# EAGLE board DUE3DOM 18052016_1322 (EAGLE 7.5.0), part 1 of 2
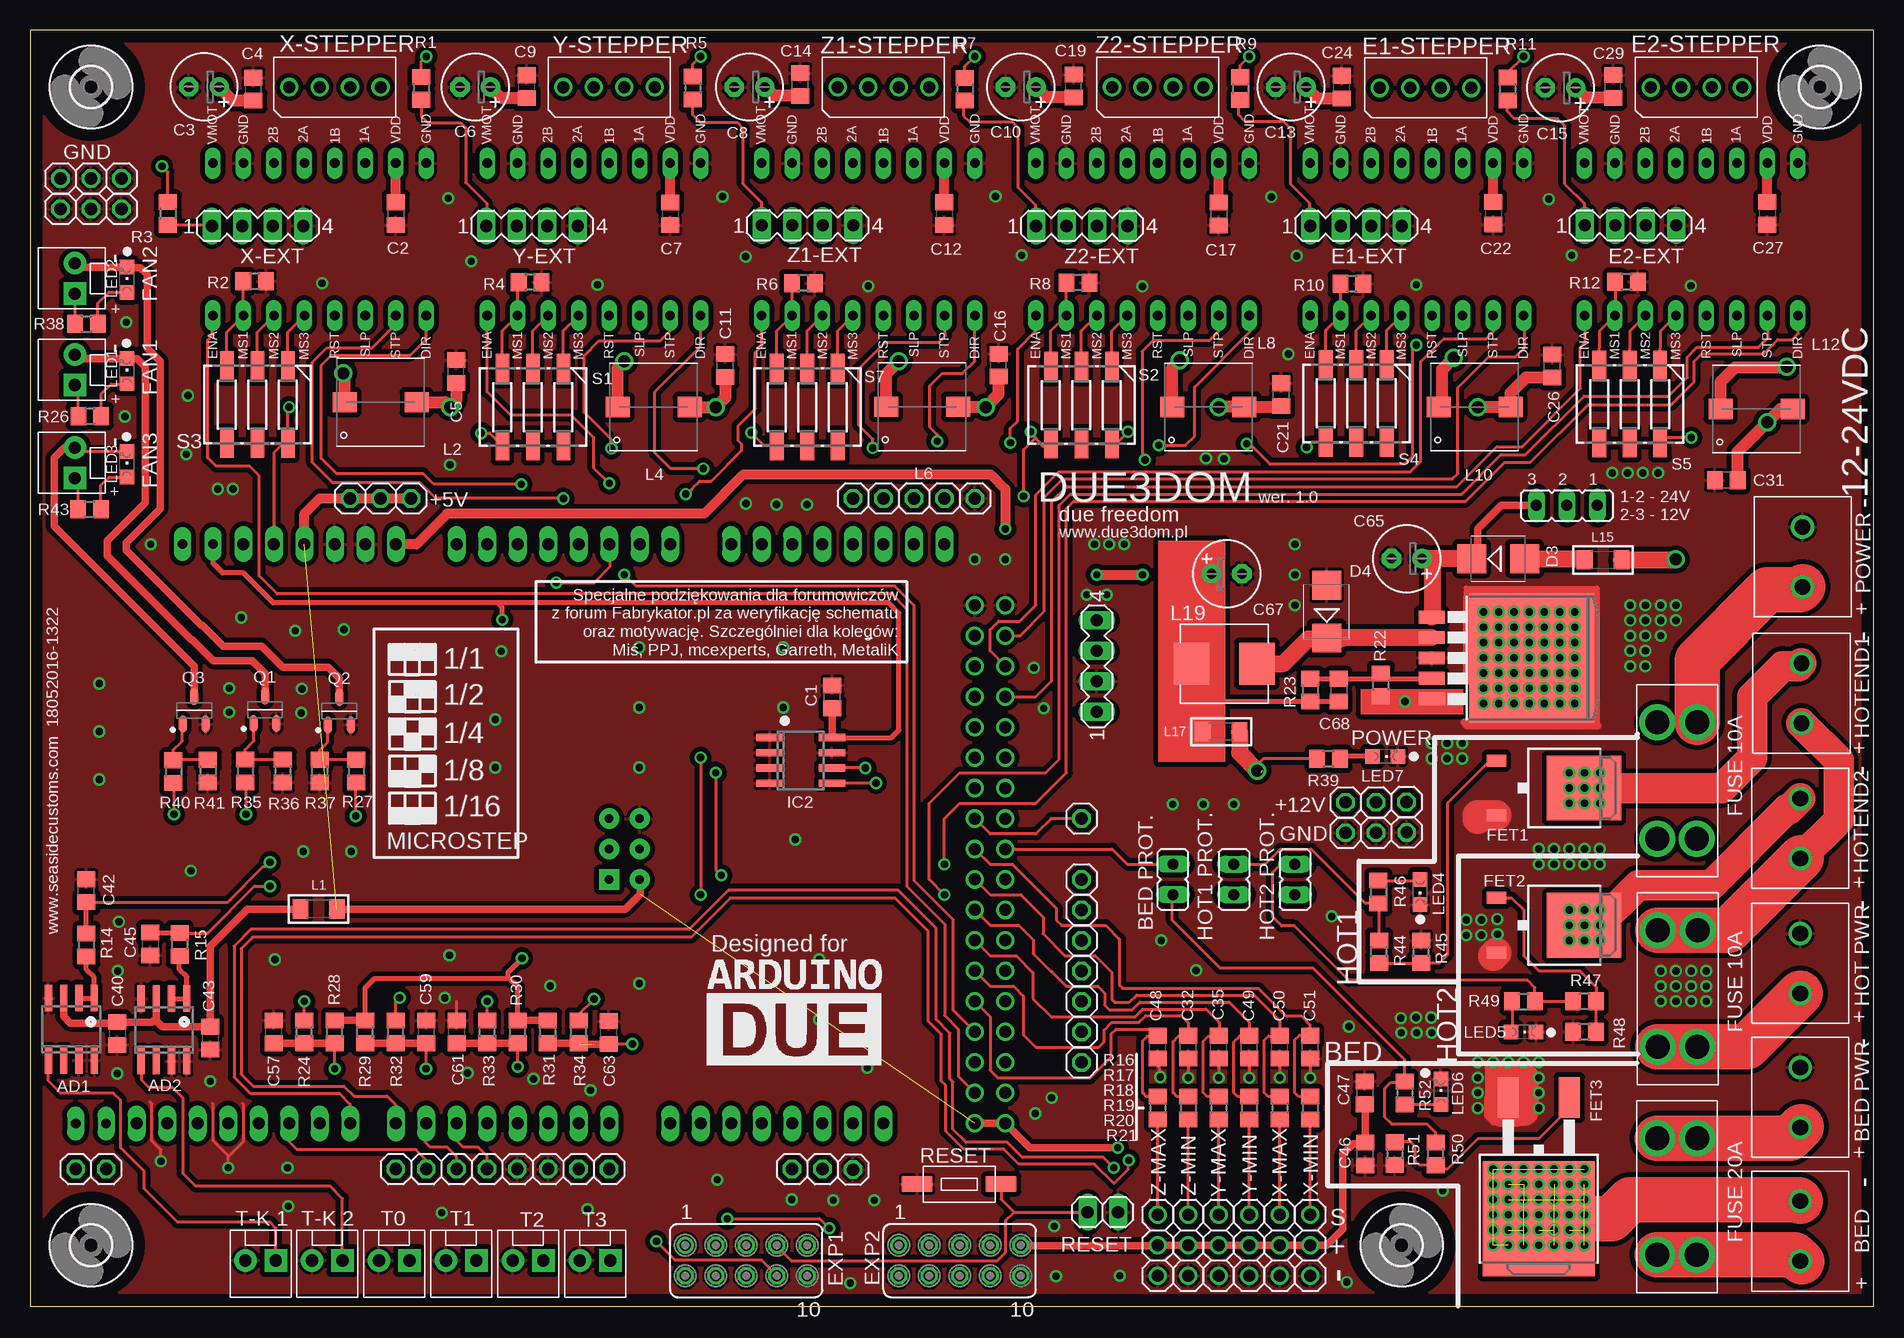
[diagram p3: board, top side]
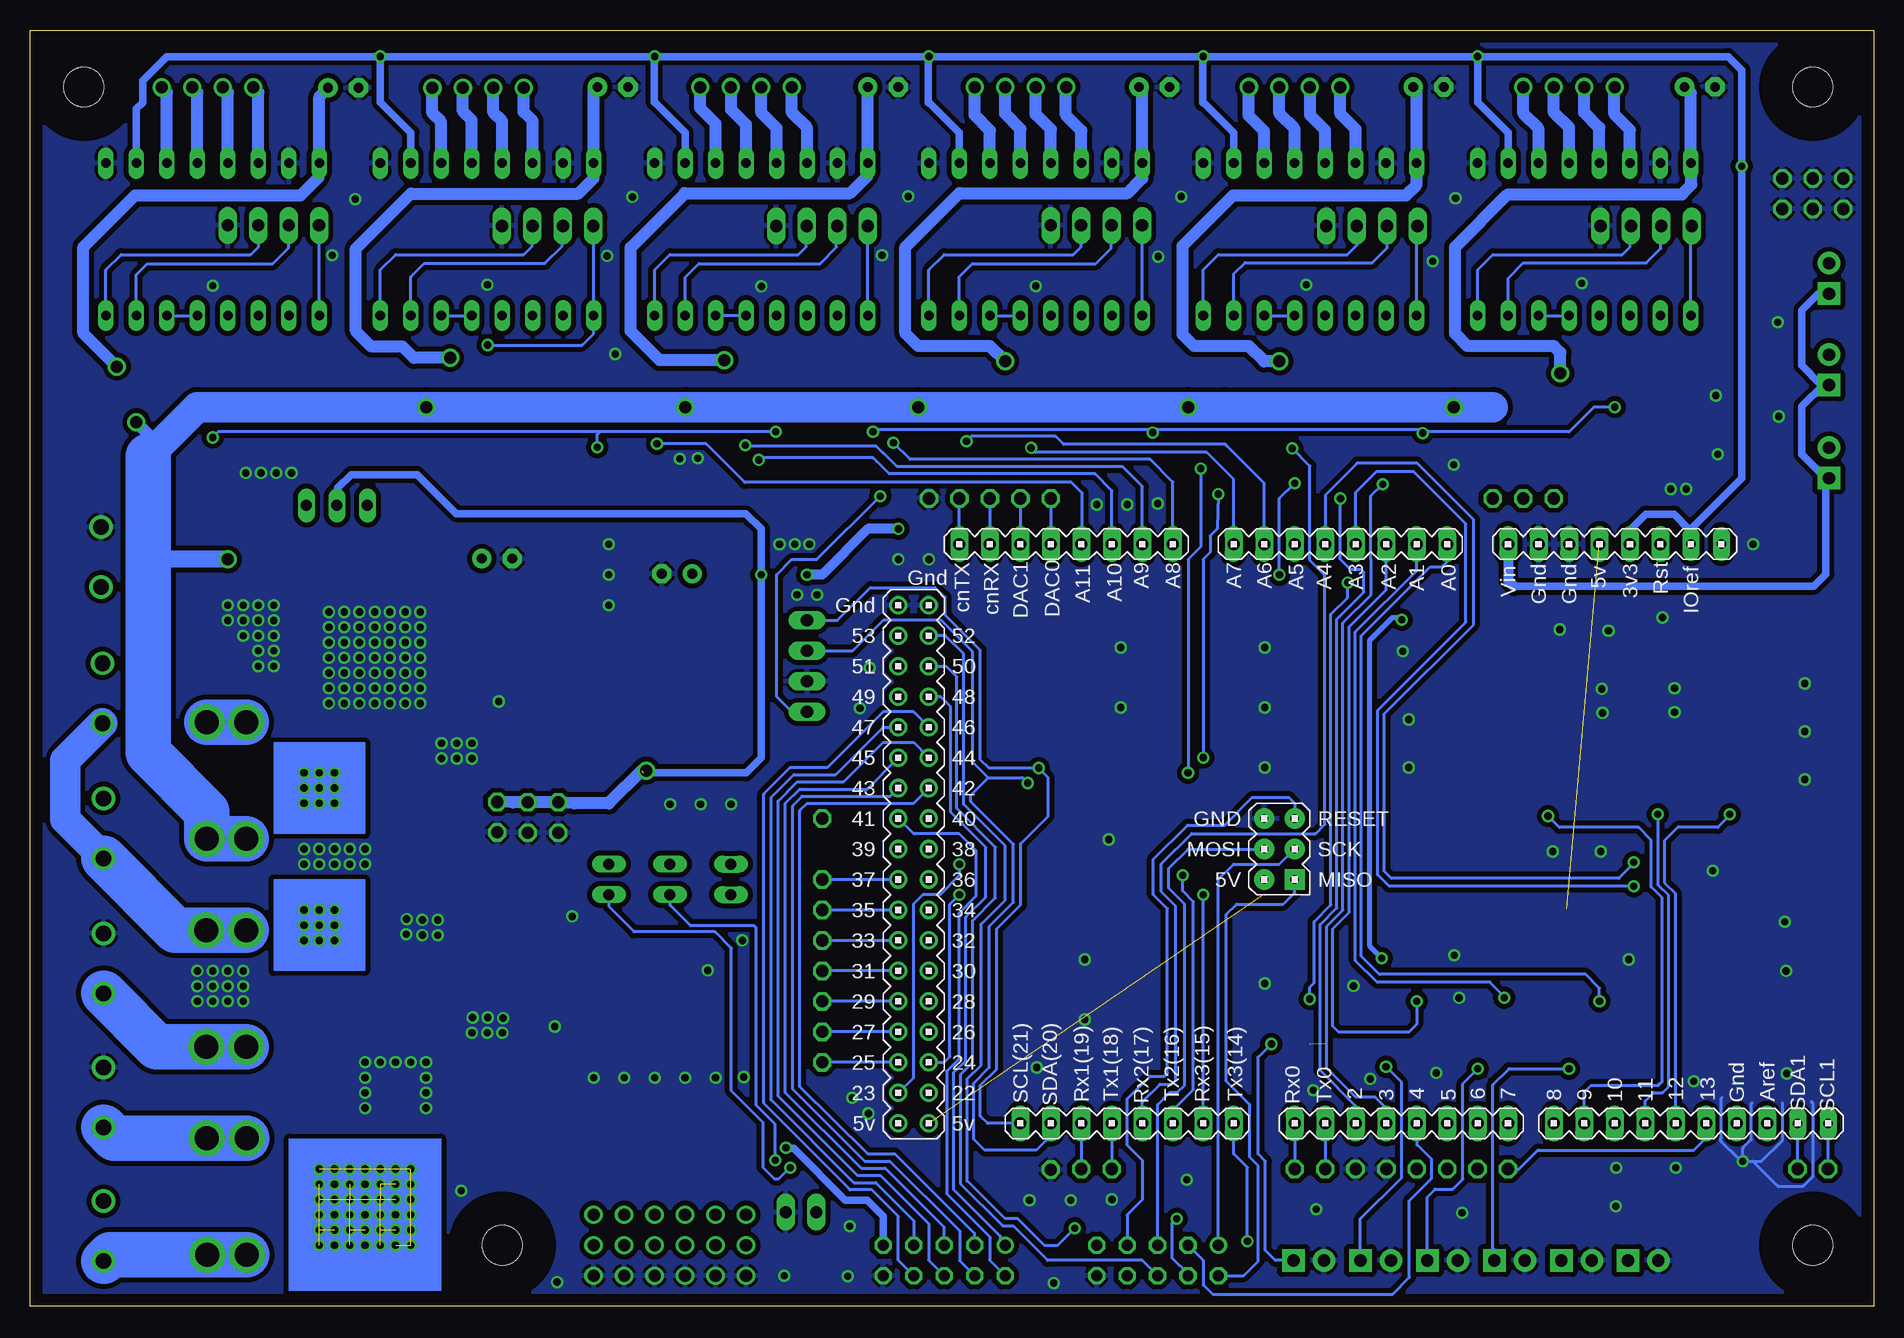
[diagram p4: board, bottom side, seen from below]

Size 153.65 x 106.35 mm. Coordinates in mm from the lower left corner, seen from the top.
Outline: 0,0 153.65,0 153.65,106.35 0,106.35 0,0
Copper layers (1*16): Top 0.035mm / dielectric 1.5mm / Bottom 0.035mm
Design rules "default *": minimum track width 10mil, minimum drill 23mil, track to track 8mil, track to pad 8mil, pad to pad 8mil, via to via 8mil, smd to smd 8mil, copper to edge 40mil, drill to drill 8mil, minimum pad ring 10mil, minimum via ring 8mil, stop-mask expansion 4mil, vias tented up to drill 24mil, thermal gap 10mil

## Footprints (pad centres in the part's own frame; a part is rotated, then mirrored left to right if it is on the bottom)
SO8 = smd 0.6 x 2.2: 1 -1.905,-2.6; 2 -0.635,-2.6; 3 0.635,-2.6; 4 1.905,-2.6; 5 1.905,2.6; 6 0.635,2.6; 7 -0.635,2.6; 8 -1.905,2.6
C0805 = smd 1.3 x 1.5: 1 -0.95,0; 2 0.95,0
E2,5-6 = drill 0.813 pad 1.6: + -1.27,0 | drill 0.813 pad 1.6 octagon: - 1.27,0
SMB = smd 2.4 x 2.4: A 2.2,0; C -2.2,0
DPAK_N-CHANNEL_MOSFET = smd 5.4 x 6.2: D 0,1.23 | smd 1 x 1.6: G -2.28,-6.07; S 2.28,-6.07
TO263 = smd 1.762 x 3.4: 1 -2.54,-6.6; 2 2.54,-6.6 | smd 9.34 x 9.6: 3 0,3.5
MA04-1 = drill 1.016 long: 1 -3.81,0; 2 -1.27,0; 3 1.27,0; 4 3.81,0
MOLEX-1X2 = drill 1.016 pad 1.88 square: 1 0,0 | drill 1.016 pad 1.88: 2 2.54,0
1X02 = drill 1.016 long: 1 -1.27,0; 2 1.27,0
3,3 = hole 3.3: 0,0
SO-08 = smd 0.6 x 2.2: 1 -1.905,-2.6; 2 -0.635,-2.6; 3 0.635,-2.6; 4 1.905,-2.6; 5 1.905,2.6; 6 0.635,2.6; 7 -0.635,2.6; 8 -1.905,2.6
TO263-5 = smd 1.067 x 2.159: 1 -3.404,-5.791; 2 -1.702,-5.791; 3 0,-5.791; 4 1.702,-5.791; 5 3.404,-5.791 | smd 10.8 x 10.41: 6 0,2.54
66100411622 = drill 1: 1 -5.08,0; 2 -2.54,0; 3 0,0; 4 2.54,0
1X01 = drill 1.016 octagon: 1 0,0
JP2 = drill 0.914 long: 1 -2.54,0; 2 0,0; 3 2.54,0
1X03 = drill 1.016: 1 -2.54,0; 2 0,0; 3 2.54,0
JP1 = drill 0.914 long: 1 0,-1.27; 2 0,1.27
L1206 = smd 1.3 x 1.6: 1 -1.524,0; 2 1.524,0
WE-PD_7332/7345_PLASTIC_BASE = smd 1.7 x 2: 1 0,3; 2 0,-3
WE-LHMI_7030/7050 = smd 2.95 x 3.5: 1 -2.725,0; 2 2.725,0
CHIPLED_0805 = smd 1.2 x 1.2: A 0,-1.05; C 0,1.05
691241710002 = drill 1.3: 1 -2.5,0; 2 2.5,0
SOT95P280X135-3N = smd 1.4 x 0.65: 1 -1.15,0.95; 2 -1.15,-0.95; 3 1.15,0
R0805 = smd 1.3 x 1.5: 1 -0.95,0; 2 0.95,0
WIDE_TACT = smd 2.54 x 1.27: 1 -3.5,0; 2 3.5,0
CTS-219-03J = smd 1.13 x 2.44: 1 -2.54,-3.215; 2 0,-3.215; 3 2.54,-3.215; 4 2.54,3.215; 5 0,3.215; 6 -2.54,3.215
STEP-STICK = drill 0.8 long: 1A 3.81,-7.62; 1B 3.81,-5.08; 2A 3.81,-2.54; 2B 3.81,0; DIR -8.89,-12.7; ENABLE -8.89,5.08; GND 3.81,2.54; GND1 3.81,-12.7; MS1 -8.89,2.54; MS2 -8.89,0; MS3 -8.89,-2.54; RESET -8.89,-5.08; SLEEP -8.89,-7.62; STP -8.89,-10.16; VDD 3.81,-10.16; VMOT 3.81,5.08
FE05-2 = drill 0.914: 1 -5.08,1.27 | drill 0.914 octagon: 2 -5.08,-1.27; 3 -2.54,1.27; 4 -2.54,-1.27; 5 0,1.27; 6 0,-1.27; 7 2.54,1.27; 8 2.54,-1.27; 9 5.08,1.27; 10 5.08,-1.27
DUE(NORMAL) = drill 1 long: 2 -16.51,30.48; 3 -19.05,30.48; 3V3 -39.37,-17.78; 4 -21.59,30.48; 5 -24.13,30.48; 5V -36.83,-17.78; 6 -26.67,30.48; 7 -29.21,30.48; 8 -33.02,30.48; 9 -35.56,30.48; 10 -38.1,30.48; 11 -40.64,30.48; 12 -43.18,30.48; 13 -45.72,30.48; A0 -24.13,-17.78; A1 -21.59,-17.78; A2 -19.05,-17.78; A3 -16.51,-17.78; A4 -13.97,-17.78; A5 -11.43,-17.78; A6 -8.89,-17.78; A7 -6.35,-17.78; A8 -1.27,-17.78; A9 1.27,-17.78; A10 3.81,-17.78; A11 6.35,-17.78; AREF -50.8,30.48; AREF1 -50.8,30.48; CANRX 13.97,-17.78; CANTX 16.51,-17.78; DAC0 8.89,-17.78; DAC1 11.43,-17.78; GND1 -48.26,30.48; GND_1 -34.29,-17.78; GND_2 -31.75,-17.78; RESET -41.91,-17.78; RX0 -11.43,30.48; RX1 6.35,30.48; RX2 1.27,30.48; RX3 -3.81,30.48; SCL 11.43,30.48; SDA 8.89,30.48; TX0 -13.97,30.48; TX1 3.81,30.48; TX2 -1.27,30.48; TX3 -6.35,30.48; VIN -29.21,-17.78 | drill 1: 5V_A 19.05,30.48; 5V_B 21.59,30.48; 22 19.05,27.94; 23 21.59,27.94; 24 19.05,25.4; 25 21.59,25.4; 26 19.05,22.86; 27 21.59,22.86; 28 19.05,20.32; 29 21.59,20.32; 30 19.05,17.78; 31 21.59,17.78; 32 19.05,15.24; 33 21.59,15.24; 34 19.05,12.7; 35 21.59,12.7; 36 19.05,10.16; 37 21.59,10.16; 38 19.05,7.62; 39 21.59,7.62; 40 19.05,5.08; 41 21.59,5.08; 42 19.05,2.54; 43 21.59,2.54; 44 19.05,0; 45 21.59,0; 46 19.05,-2.54; 47 21.59,-2.54; 48 19.05,-5.08; 49 21.59,-5.08; 50 19.05,-7.62; 51 21.59,-7.62; 52 19.05,-10.16; 53 21.59,-10.16; GND_A 19.05,-12.7; GND_B 21.59,-12.7 | drill 0.7 pad 1.676: 5V_ICSP -8.89,5.08; GND_ICSP -8.89,10.16; MOSI_ICSP -8.89,7.62; RESET_ICSP -11.43,5.08; SCK_ICSP -11.43,7.62 | drill 0.8 pad 1.422 long: IOREF -44.45,-17.78; NC -46.99,-17.78; SCL1 -55.88,30.48; SDA1 -53.34,30.48 | drill 0.7 pad 1.676 square: MISO_ICSP -11.43,10.16
KEYSTONE_3568 = drill 2: 1 3.124,5.029; 2 3.124,1.702; 3 12.827,5.004; 4 12.827,1.702

## Placement (x,y rotation side)
AD1  AD597  [SO8]  3.44,23.08 0 top
AD2  AD597  [SO8]  11.16,23.03 0 top
C1  100nF  [C0805]  66.86,50.78 90 top
C2  100nF  [C0805]  30.49,91.05 270 top
C3  100uF 35V  [E2,5-6]  14.5,101.61 180 top
C4  100nF 50V  [C0805]  18.62,101.42 90 top
C5  100nF 50V  [C0805]  35.5,77.89 90 top
C6  100uF 35V  [E2,5-6]  37.1,101.6 180 top
C7  100nF  [C0805]  53.34,91.04 270 top
C8  100uF 35V  [E2,5-6]  59.96,101.6 180 top
C9  100nF 50V  [C0805]  41.39,101.63 90 top
C10  100uF 35V  [E2,5-6]  82.57,101.6 180 top
C11  100nF 50V  [C0805]  57.94,78.39 90 top
C12  100nF  [C0805]  76.2,91.05 270 top
C13  100uF 35V  [E2,5-6]  105.08,101.6 180 top
C14  100nF 50V  [C0805]  64.19,101.81 90 top
C15  100uF 35V  [E2,5-6]  127.54,101.53 180 top
C16  100nF 50V  [C0805]  80.71,78.41 90 top
C17  100nF  [C0805]  99.07,91.02 270 top
C19  100nF 50V  [C0805]  86.96,101.69 90 top
C21  100nF 50V  [C0805]  104.27,75.96 90 top
C22  100nF  [C0805]  121.93,91.08 270 top
C24  100nF 50V  [C0805]  109.32,101.59 90 top
C26  100nF 50V  [C0805]  126.85,78.35 90 top
C27  100nF  [C0805]  144.78,91.07 270 top
C29  100nF 50V  [C0805]  131.92,101.64 90 top
C31  100nF 50V  [C0805]  141.36,68.84 180 top
C32  100nF  [C0805]  96.52,21.59 90 top
C35  100nF  [C0805]  99.06,21.59 90 top
C40  100nF  [C0805]  7.27,22.72 270 top
C42  1uF  [C0805]  4.7,34.63 90 top
C43  100nF  [C0805]  15.01,22.34 270 top
C45  1uF  [C0805]  10.01,30.18 270 top
C46  100nF  [C0805]  111.27,12.68 90 top
C47  1uF  [C0805]  111.22,17.78 270 top
C48  100nF  [C0805]  93.98,21.59 90 top
C49  100nF  [C0805]  101.6,21.59 90 top
C50  100nF  [C0805]  104.14,21.59 90 top
C51  100nF  [C0805]  106.68,21.59 90 top
C57  10uF  [C0805]  20.32,22.86 90 top
C59  10uF  [C0805]  33.04,22.86 90 top
C61  10uF  [C0805]  35.56,22.86 90 top
C63  10uF  [C0805]  48.23,22.81 90 top
C65  100uF 35V  [E2,5-6]  114.73,62.3 180 top
C67  100uF 35V  [E2,5-6]  99.73,61.03 0 top
C68  1nF  [C0805]  109.05,51.34 270 top
D3  B340B 3A 40V  [SMB]  122.35,62.3 0 top
D4  B340B 3A 40V  [SMB]  108.05,57.88 90 top
FET1  DPAK_N-CHANNEL_MOSFET  [DPAK_N-CHANNEL_MOSFET]  128.27,43.18 270 top
FET2  DPAK_N-CHANNEL_MOSFET  [DPAK_N-CHANNEL_MOSFET]  128.27,31.75 270 top
FET3  IRLR8743  [TO263]  125.73,10.79 180 top
H1  X-EXT  [MA04-1]  18.97,90.02 0 top
H2  Y-EXT  [MA04-1]  41.83,90.02 0 top
H3  Z1-EXT  [MA04-1]  64.79,90.07 0 top
H4  Z2-EXT  [MA04-1]  87.65,90.02 0 top
H5  E1-EXT  [MA04-1]  110.51,90.02 0 top
H6  E2-EXT  [MA04-1]  133.37,90.07 0 top
H13  FAN1  [MOLEX-1X2]  3.74,76.76 90 top
H14  FAN2  [MOLEX-1X2]  3.74,84.38 90 top
H15  FAN3  [MOLEX-1X2]  3.74,69 90 top
H16  I2C  [MA04-1]  88.9,53.34 90 top
H17  NTC1  [MOLEX-1X2]  31.62,3.81 180 top
H18  NTC2  [MOLEX-1X2]  37.2,3.81 180 top
H19  NTC3  [MOLEX-1X2]  42.78,3.81 180 top
H20  NTC4  [MOLEX-1X2]  48.36,3.81 180 top
H21  RST  [1X02]  89.4,7.84 180 top
H22  TC-K1  [MOLEX-1X2]  20.49,3.81 180 top
H23  TC-K2  [MOLEX-1X2]  26.04,3.81 180 top
H24  MOUNT-HOLE3.3  [3,3]  5.08,5.08 0 top
H25  MOUNT-HOLE3.3  [3,3]  114.3,5.08 0 top
H26  MOUNT-HOLE3.3  [3,3]  5.08,101.6 0 top
H28  MOUNT-HOLE3.3  [3,3]  149.16,101.6 0 top
IC2  24LC256SN  [SO-08]  64.23,45.48 270 top
IC5  LM2596S  [TO263-5]  122.6,54.02 270 top
J1  X-MOT  [66100411622]  24.13,101.6 180 top
J2  Y-MOT  [66100411622]  46.99,101.6 180 top
J3  Z1-MOT  [66100411622]  69.85,101.6 180 top
J4  Z2-MOT  [66100411622]  92.71,101.6 180 top
J5  E1-MOT  [66100411622]  115.03,101.52 180 top
J6  E2-MOT  [66100411622]  137.59,101.56 180 top
JP1  [1X01]  31.75,67.31 0 top
JP2  [1X01]  87.63,27.94 0 top
JP3  [1X01]  87.63,25.4 0 top
JP4  [1X01]  87.63,22.86 0 top
JP5  [1X01]  87.63,20.32 0 top
JP6  [1X01]  3.81,11.43 0 top
JP7  12/24  [JP2]  128.07,66.74 180 top
JP8  X-MIN  [1X03]  106.68,5.08 90 top
JP9  X-MAX  [1X03]  104.14,5.08 90 top
JP10  Y-MIN  [1X03]  101.6,5.08 90 top
JP11  Y-MAX  [1X03]  99.06,5.08 90 top
JP12  Z-MIN  [1X03]  96.52,5.08 90 top
JP13  Z-MAX  [1X03]  93.98,5.08 90 top
JP14  [1X01]  6.35,11.43 0 top
JP15  [1X01]  45.72,11.43 0 top
JP16  [1X01]  48.26,11.43 0 top
JP17  [1X01]  63.5,11.43 0 top
JP18  [1X01]  66.04,11.43 0 top
JP19  [1X01]  30.48,11.43 0 top
JP20  [1X01]  35.55,11.43 0 top
JP21  [1X01]  33.02,11.43 0 top
JP22  [1X01]  87.63,35.56 0 top
JP23  [1X01]  109.63,41.99 0 top
JP24  [1X01]  29.21,67.31 0 top
JP25  [1X01]  38.09,11.43 0 top
JP26  [1X01]  76.2,67.31 0 top
JP27  [1X01]  87.63,40.64 0 top
JP28  [1X01]  87.63,33.02 0 top
JP29  [1X01]  87.63,30.48 0 top
JP30  [1X01]  26.67,67.31 0 top
JP31  [1X01]  112.17,41.99 0 top
JP32  [1X01]  114.71,42.02 0 top
JP33  [1X01]  2.54,93.98 0 top
JP34  [1X01]  5.08,93.98 0 top
JP35  [1X01]  7.62,93.98 0 top
JP36  [1X01]  7.62,91.44 0 top
JP37  [1X01]  2.54,91.44 0 top
JP38  [1X01]  78.74,67.31 0 top
JP39  [1X01]  5.08,91.44 0 top
JP40  [1X01]  40.61,11.43 0 top
JP41  [1X01]  43.18,11.43 0 top
JP42  [1X01]  68.58,11.38 0 top
JP43  [1X01]  112.17,39.45 0 top
JP44  [1X01]  109.63,39.45 0 top
JP45  [1X01]  114.72,39.48 0 top
JP46  [JP1]  95.25,35.56 180 top
JP47  [JP1]  105.41,35.56 0 top
JP48  [JP1]  100.33,35.56 0 top
JP52  [1X01]  73.66,67.31 0 top
JP53  [1X01]  68.58,67.31 0 top
JP54  [1X01]  71.12,67.31 0 top
L1  600R 2A  [L1206]  24.05,33.1 0 top
L2  8.2uH 2.7A  [WE-PD_7332/7345_PLASTIC_BASE]  29.21,75.33 90 top
L4  8.2uH 2.7A  [WE-PD_7332/7345_PLASTIC_BASE]  51.96,74.93 90 top
L6  8.2uH 2.7A  [WE-PD_7332/7345_PLASTIC_BASE]  74.34,74.95 90 top
L8  8.2uH 2.7A  [WE-PD_7332/7345_PLASTIC_BASE]  98.2,74.94 90 top
L10  8.2uH 2.7A  [WE-PD_7332/7345_PLASTIC_BASE]  120.38,74.93 90 top
L12  8.2uH 2.7A  [WE-PD_7332/7345_PLASTIC_BASE]  143.88,74.77 90 top
L15  600R 2A  [L1206]  131.09,62.2 180 top
L17  600R 2A  [L1206]  99.28,47.87 0 top
L19  33uH 1.9A 0.2R WE-LHMI  [WE-LHMI_7030/7050]  99.52,53.54 180 top
LED1  LED1  [CHIPLED_0805]  8.07,77.92 0 top
LED2  LED2  [CHIPLED_0805]  8.07,85.54 0 top
LED3  LED3  [CHIPLED_0805]  8.07,70.16 0 top
LED4  HOT1 LED  [CHIPLED_0805]  115.83,34.52 180 top
LED5  HOT2 LED  [CHIPLED_0805]  124.46,22.86 270 top
LED6  BED LED  [CHIPLED_0805]  117.58,17.87 0 top
LED7  POWER LED  [CHIPLED_0805]  112.94,45.82 270 top
P1  HOTEND1  [691241710002]  147.62,51.08 90 top
P2  HOT PWR  [691241710002]  147.52,28.56 90 top
P3  HOTEND2  [691241710002]  147.52,39.82 90 top
P4  BED  [691241710002]  147.52,6.25 90 top
P5  BED PWR  [691241710002]  147.52,17.4 90 top
P7  POWER  [691241710002]  147.72,62.44 90 top
Q1  IRLML0030TRPBF  [SOT95P280X135-3N]  19.59,49.7 90 top
Q2  IRLML0030TRPBF  [SOT95P280X135-3N]  25.78,49.59 90 top
Q3  IRLML0030TRPBF  [SOT95P280X135-3N]  13.68,49.65 90 top
R1  100K  [R0805]  32.61,101.49 270 top
R2  100K  [R0805]  18.72,85.4 180 top
R3  100K  [R0805]  11.49,91.06 270 top
R4  100K  [R0805]  41.68,85.33 180 top
R5  100K  [R0805]  55.22,101.51 270 top
R6  100K  [R0805]  64.45,85.26 180 top
R7  100K  [R0805]  77.91,101.41 270 top
R8  100K  [R0805]  87.34,85.29 180 top
R9  100K  [R0805]  100.87,101.46 270 top
R10  100K  [R0805]  110.15,85.19 180 top
R11  100K  [R0805]  123.13,101.43 270 top
R12  100K  [R0805]  133.04,85.36 180 top
R14  10K  [R0805]  4.69,30.1 270 top
R15  10K  [R0805]  12.46,30.15 270 top
R16  10K  [R0805]  106.68,16.51 270 top
R17  10K  [R0805]  104.14,16.51 270 top
R18  10K  [R0805]  101.6,16.51 270 top
R19  10K  [R0805]  99.06,16.51 270 top
R20  10K  [R0805]  96.52,16.51 270 top
R21  10K  [R0805]  93.98,16.51 270 top
R22  1K  [R0805]  112.58,51.78 90 top
R23  8K7  [R0805]  106.69,51.34 270 top
R24  100R  [R0805]  22.86,22.86 90 top
R26  2K7  [R0805]  4.98,74.18 0 top
R27  100R  [R0805]  27.19,44.59 270 top
R28  4K7  [R0805]  25.4,22.86 90 top
R29  4K7  [R0805]  27.92,22.86 90 top
R30  4K7  [R0805]  40.64,22.86 90 top
R31  4K7  [R0805]  43.16,22.86 90 top
R32  100R  [R0805]  30.48,22.86 90 top
R33  100R  [R0805]  38.1,22.86 90 top
R34  100R  [R0805]  45.72,22.86 90 top
R35  100R  [R0805]  17.93,44.6 270 top
R36  10K  [R0805]  21.07,44.6 270 top
R37  10K  [R0805]  24.13,44.59 270 top
R38  2K7  [R0805]  4.71,81.86 0 top
R39  2K7  [R0805]  108.21,45.6 180 top
R40  100R  [R0805]  11.95,44.55 270 top
R41  10K  [R0805]  14.83,44.59 270 top
R43  2K7  [R0805]  4.95,66.42 0 top
R44  100R  [R0805]  112.42,29.54 90 top
R45  10K  [R0805]  115.93,29.54 90 top
R46  470R  [R0805]  112.37,34.52 270 top
R47  100R  [R0805]  129.54,25.4 180 top
R48  10K  [R0805]  129.54,22.86 180 top
R49  470R  [R0805]  124.46,25.4 0 top
R50  100R  [R0805]  117.14,12.7 90 top
R51  10K  [R0805]  113.72,12.71 270 top
R52  470R  [R0805]  114.56,17.77 270 top
RESET  RESET  [WIDE_TACT]  77.42,10.18 180 top
S1  219-03J  [CTS-219-03J]  41.91,74.93 180 top
S2  219-03J  [CTS-219-03J]  87.62,75.09 180 top
S3  219-03J  [CTS-219-03J]  18.95,75.13 180 top
S4  219-03J  [CTS-219-03J]  110.52,75.23 180 top
S5  219-03J  [CTS-219-03J]  133.31,75.17 180 top
S7  219-03J  [CTS-219-03J]  64.77,74.93 180 top
STEPSTICK-E1  STEP-STICK  [STEP-STICK]  111.76,91.44 90 top
STEPSTICK-E2  STEP-STICK  [STEP-STICK]  134.62,91.44 90 top
STEPSTICK-X  STEP-STICK  [STEP-STICK]  20.32,91.44 90 top
STEPSTICK-Y  STEP-STICK  [STEP-STICK]  43.18,91.44 90 top
STEPSTICK-Z1  STEP-STICK  [STEP-STICK]  66.04,91.44 90 top
STEPSTICK-Z2  STEP-STICK  [STEP-STICK]  88.9,91.44 90 top
SV4  EXP2  [FE05-2]  77.47,3.81 0 top
SV5  EXP1  [FE05-2]  59.69,3.81 0 top
U$1  DUE(NORMAL)  [DUE(NORMAL)]  59.69,45.72 180 bottom
U$11  KEYSTONE_3568  [KEYSTONE_3568]  133.91,51.77 270 top
U$12  KEYSTONE_3568  [KEYSTONE_3568]  133.94,34.47 270 top
U$13  KEYSTONE_3568  [KEYSTONE_3568]  133.89,17.14 270 top